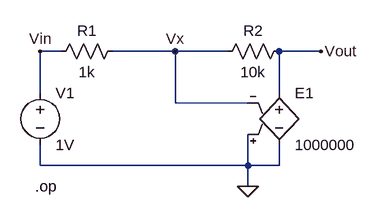
[diagram p0: schematic ltinversora.asc]
ltinversora.asc, the LTspice schematic file:
Version 4
SHEET 1 880 680
WIRE -48 112 -80 112
WIRE 128 112 32 112
WIRE 208 112 128 112
WIRE 352 112 288 112
WIRE -80 176 -80 112
WIRE 288 176 288 112
WIRE 128 192 128 112
WIRE 240 192 128 192
WIRE -80 288 -80 256
WIRE 240 288 240 240
WIRE 240 288 -80 288
WIRE 288 288 288 256
WIRE 288 288 240 288
WIRE 240 320 240 288
FLAG 240 320 0
FLAG -80 112 Vin
FLAG 352 112 Vout
FLAG 128 112 Vx
SYMBOL voltage -80 160 R0
SYMATTR InstName V1
SYMATTR Value 1V
SYMBOL res 48 96 R90
WINDOW 0 0 56 VBottom 2
WINDOW 3 32 56 VTop 2
SYMATTR InstName R1
SYMATTR Value 1k
SYMBOL res 304 96 R90
WINDOW 0 0 56 VBottom 2
WINDOW 3 32 56 VTop 2
SYMATTR InstName R2
SYMATTR Value 10k
SYMBOL e2 288 160 R0
SYMATTR InstName E1
SYMATTR Value 1000000
TEXT -88 320 Left 2 !.op

The netlist it stands for:
* ltinversora.asc
V1 Vin 0 1V
R1 Vx Vin 1k
R2 Vout Vx 10k
E1 Vout 0 0 Vx 1000000
.op
.backanno
.end

* Results of the author's LTspice run, read from the files saved beside the schematic
* Operating Point:
*   V(vin) = 1 V
*   V(vx) = 833.3 mV
*   V(vout) = -833.3 mV
*   I(R2) = -166.7 µA
*   I(R1) = -166.7 µA
*   I(E1) = 166.7 µA
*   I(V1) = -166.7 µA